# Altium schematic sheet ESP_Xung.SchDoc
size 381 x 241 mm; SheetNumber: 1; SheetTotal: 1
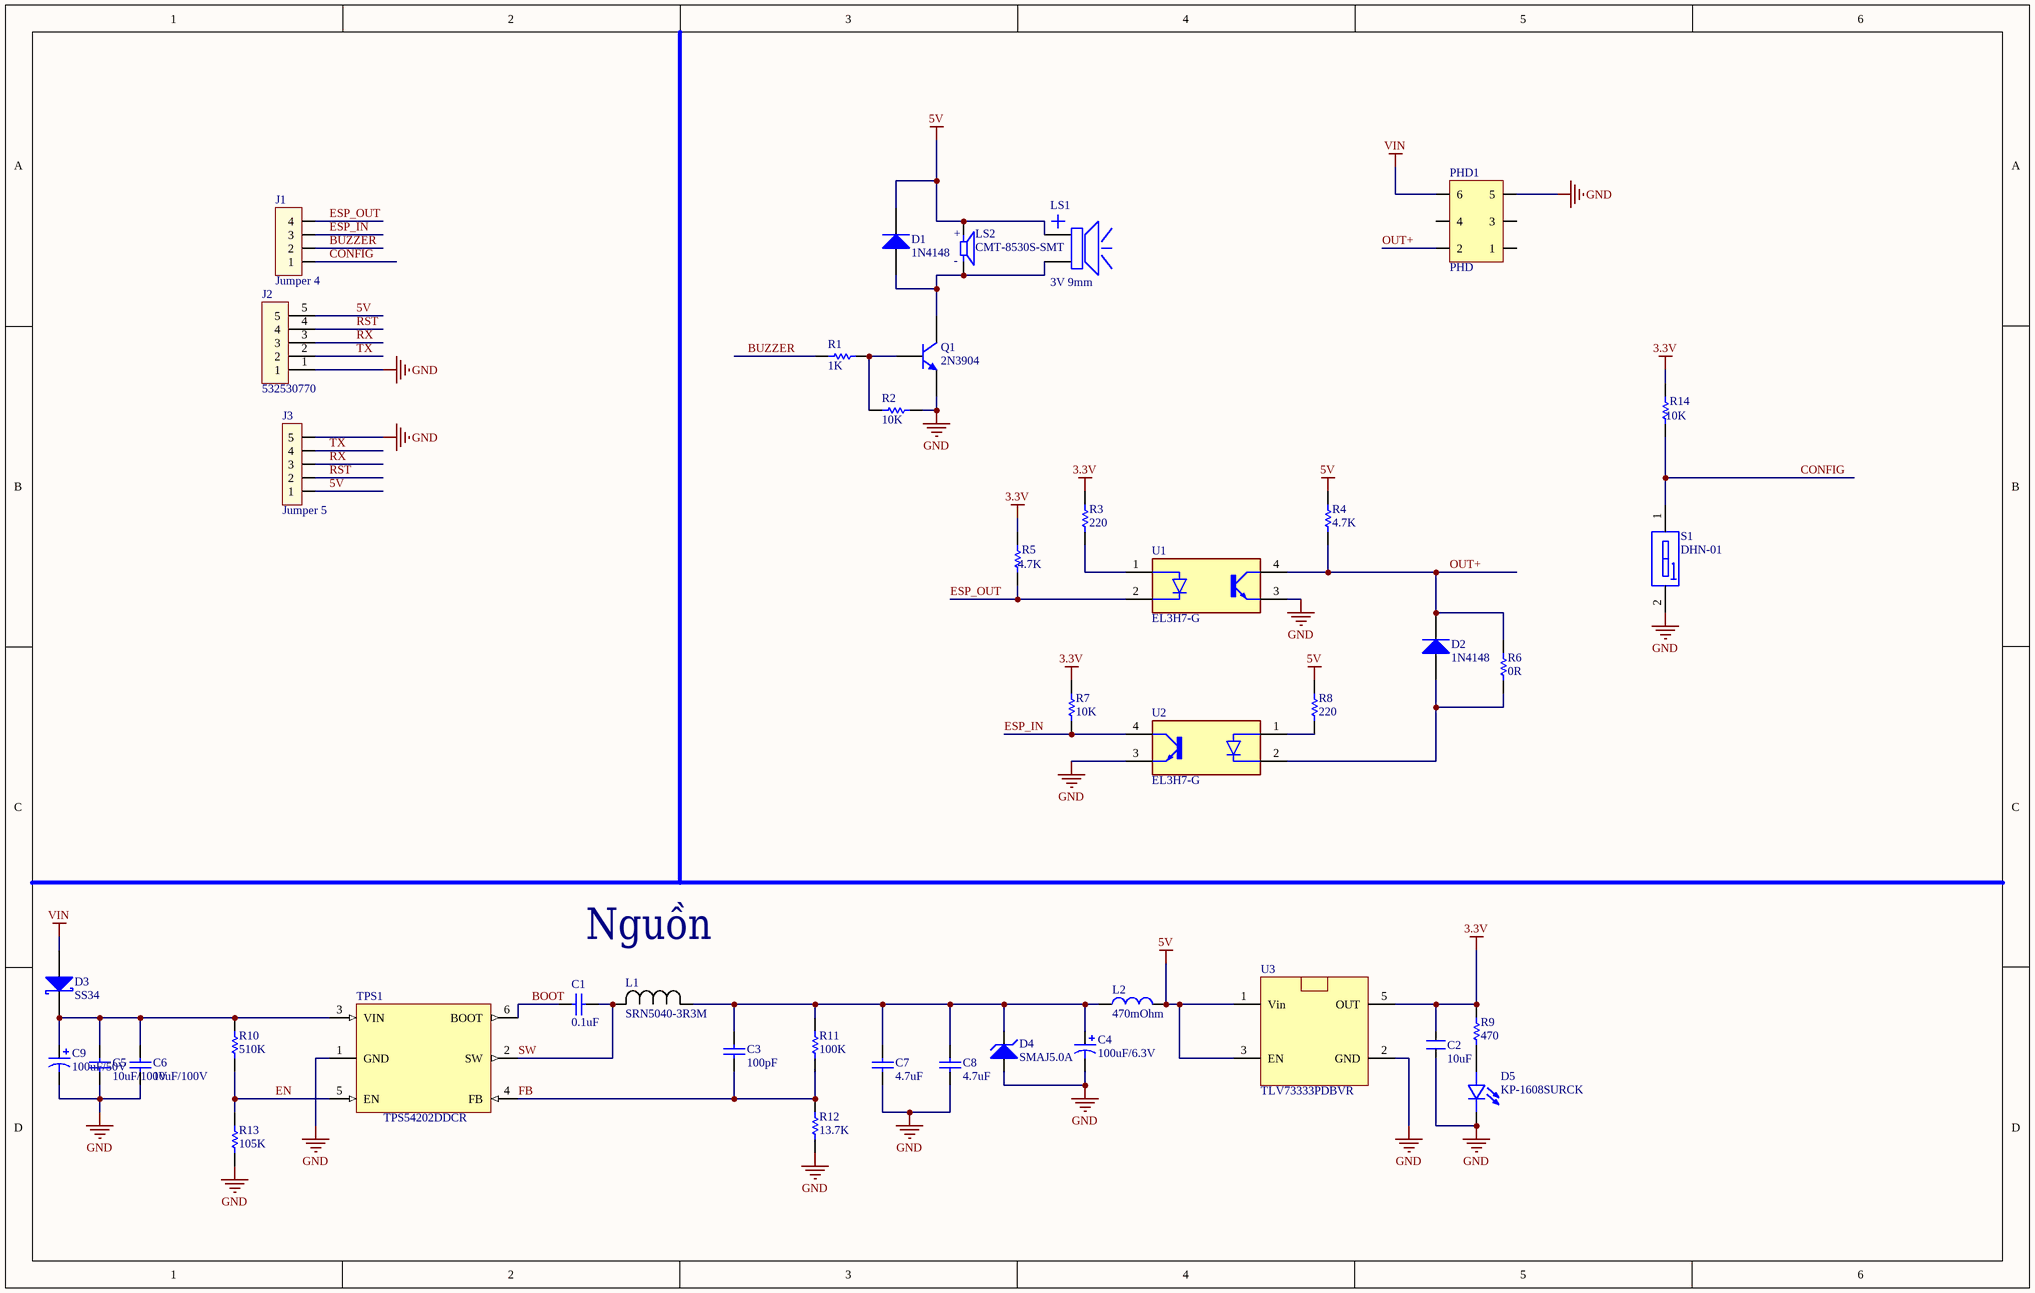
[diagram p0: ESP_Xung.SchDoc]

## Parts
C1  0.1uF  [0603 - C]
C2  10uF  [SM-0805]
C3  100pF  [0603 - C]
C4  value 100uF/6.3V  [3528 - TANTALUM]  (hidden comment: 107B)
C5  10uF/100V  [1210 - C]
C6  10uF/100V  [1210 - C]
C7  Size: 4.7uF  [0603 - C]  (hidden comment: C0603: 4.7uF)
C8  Size: 4.7uF  [0603 - C]  (hidden comment: C0603: 4.7uF)
C9  100uF/50V  [CAP-ALU-SMD 8x11.7x3.1]
D1  1N4148  [SOD-123]
D2  1N4148  [SOD-123]
D3  SS34  [SOD-123]
D4  SMAJ5.0A  [Diode - SMA]
D5  KP-1608SURCK  [LED_KP-1608SURCK]
J1  Jumper 4  [JP4]
J2  532530770  [MOLEX_532530770]
J3  Jumper 5  [JP5 - 1]
L1  SRN5040-3R3M  [IND_SRN5040_BRN]
L2  470mOhm  [0603 - L]
LS1  3V 9mm  [Buzzer]
LS2  CMT-8530S-SMT  [CUI_CMT-8530S-SMT]
PHD1  PHD  [PHD 2.0 2x3]
Q1  2N3904  [SOT23B]
R1  1K  [0603 - R]
R2  10K  [0603 - R]
R3  220  [0603 - R]
R4  4.7K  [0603 - R]
R5  4.7K  [0603 - R]
R6  0R  [0603 - R]
R7  10K  [0603 - R]
R8  220  [0603 - R]
R9  470  [0603 - R]
R10  510K  [0603 - R]
R11  100K  [0603 - R]
R12  13.7K  [0603 - R]
R13  105K  [0603 - R]
R14  10K  [0603 - R]
S1  DHN-01  [DSHP01TSGDER]
TPS1  TPS54202DDCR  [SOT95P280X110-6N]
U1  EL3H7-G  [SOIC127P700X200-4N]
U2  EL3H7-G  [SOIC127P700X200-4N]
U3  TLV73333PDBVR  [SOT23-5]

## Nets
3.3V: C2.2 R3.1 R5.2 R7.1 R9.1 R14.2 U3.5(OUT)
5V: D1.2(K) J2.5 J3.1 L2.2 LS1.1 LS2.P R4.1 R8.1 U3.1(Vin) U3.3(EN)
GND: C2.1 C4.2 C5.1 C6.2 C7.1 C8.1 C9.2 D4.1(A) D5.2(C) J2.1 J3.5 PHD1.4(5) Q1.2(E) R2.2 R12.2 R13.2 S1.2(A2) TPS1.1(GND) U1.3(E) U2.3(E) U3.2(GND)
VIN: D3.1(A) PHD1.5(6)
BOOT: C1.2 TPS1.6(BOOT)
BUZZER: J1.2 R1.1
CONFIG: J1.1 R14.1 S1.1(A1)
EN: R10.2 R13.1 TPS1.5(EN)
ESP_IN: J1.3 R7.2 U2.4(CO)
ESP_OUT: J1.4 R5.1 U1.2(C)
FB: C3.2 R11.2 R12.1 TPS1.4(FB)
OUT+: D2.2(K) PHD1.1 R4.2 R6.1 U1.4(CO)
RST: J2.4 J3.2
RX: J2.3 J3.3
SW: C1.1 L1.2 TPS1.2(SW)
TX: J2.2 J3.4
NetC3_1: C3.1 C4.1 C7.2 C8.2 D4.2(K) L1.1 L2.1 R11.1
NetC5_2: C5.2 C6.1 C9.1 D3.2(K) R10.1 TPS1.3(VIN)
NetD1_1: D1.1(A) LS1.2 LS2.N Q1.3(C)
NetD2_1: D2.1(A) R6.2 U2.2(C)
NetD5_1: D5.1(A) R9.2
NetQ1_1: Q1.1(B) R1.2 R2.1
NetR3_2: R3.2 U1.1(A)
NetR8_2: R8.2 U2.1(A)

Not connected (* = marked no-connect by the designer): PHD1 2(3) 3(4); U3 4(NC)

## Notes on the sheet
- Nguồn
- (in symbol CMT-8530S-SMT) +; -

## Library data of the parts
C1 C3 = Cap 0603 1nF: CAP CER 1000PF 50V C0G/NP0 0603; MPN: CL10C102JB8NNNC; MFR: SAMSUNG; Company ID: VT_TỤ ĐIỆN_C0603 1nF; Size: C0603: 1nF
  C1: Value: 0.1uF
  C3: Value: 100pF
C2 = CM: Cap SMD; Value: 103
C4 = Cap Tan 3528 100uF/6.3V: CAP TANT 100UF 6.3V 10% 1411; MPN: T491B107K006AT; MFR: Kemet; Company ID: VT_CAP TAN 100uF 6.3V
C5 C6 = Cap 1210 10uF: CAP CER 10UF 100V X7S 1210; MFR: Murata Electronics; MPN: GRM32EC72A106KE05L; Company ID: VT_CAP_C1210 10uF 100V; Size: C1210: 10uF/100V; Value: 10uF/100V
C7 C8 = Cap 0603 4.7uF: CAP CER 4.7UF 6.3V X5R 0603; MFR: Taiyo Yuden; MPN: JMK107BJ475KA-T; Company ID: VT_CAP_0603 4.7uF; Value: C0603: 4.7uF
C9 = Cap Alu 100uF/50V: CAP ALUM 100UF 20% 50V SMD; MPN: UWT1H101MNL1GS; MFR: Nichicon; Company ID: VT_CAP ALU 100uF 50V; Value: 100uF/50V
D1 D2 = Diode 1N4148: DIODE GEN PURP 100V 300MA SOD123; MPN: 1N4148W-7-F; MFR: DIODES; Company ID: VT_DIODE_1N4148W-7-F
D3 = Diode SS34: DIODE SCHOTTKY 40V 3A SMA; MPN: NRVBA340T3G; MFR: ON Semiconductor; Company ID: VT_DIODE_ SS34
D4 = Diode SMAJ5.0A: TVS DIODE 5VWM 9.2VC SMA; MFR: Littelfuse Inc.; Company ID: VT_DIODE_ SMAJ5.0A; MPN: SMAJ5.0A
D5 = KP-1608SURCK: LED; SMD; 0603; red; 50-150mcd; 1.6x0.8mm; 120Â°; 20mA;; MF: Kingbright; SnapEDA_Link: https://www.snapeda.com/parts/KP-1608SURCK/Kingbright/view-part/?ref=snap; Package: 0603 Kingbright; Value: *; MP: KP-1608SURCK; Check_prices: https://www.snapeda.com/parts/KP-1608SURCK/Kingbright/view-part/?ref=eda
J1 = JP4: Jumper 4, 2.54mmx4
J2 = 532530770: 2.00mm Pitch, Micro-Latch PCB Header, Single Row, Vertical, Through Hole, Tin (Sn) Plating, 7 Circuits, Tray, 3.50mm PC Tail Length; Package: None; MP: 532530770; Value: *; Price: None; Availability: Unavailable
J3 = JP5: Jumper 5, 2.54mmx5
L1 = SRN5040-3R3M: No Description Available; Mfr_Name: Bourns Electronics; Digi-Key_Part_Number_3: SRN5040-3R3MDKR-ND; Digi-Key_Part_Number_2: SRN5040-3R3MCT-ND; Digi-Key_Part_Number_1: SRN5040-3R3MTR-ND
L2 = Inductor 0603 470mOhm: FERRITE BEAD 470 OHM 0603 1LN; MPN: BLM18PG471SN1D; MFR": Murata; Company ID: VT_IND_0603 470mOhm; Size: L0603: 470mOhm; Value: 470mOhm
LS1 = Speaker: Buzzer 9*6mm (D*h); MFR: China; MPN: TMB09A03; Company ID: VT_Buzzer 3V 9mm
LS2 = CMT-8530S-SMT: Buzzers Transducer, Externally Driven Magnetic 3.6 V 90mA 2.73kHz 87dB @ 3.6V, 10cm Surface Mount Solder Pads; MF: CUI DEVICES; SnapEDA_Link: https://www.snapeda.com/parts/CMT-8530S-SMT/CUI+Devices/view-part/?ref=snap; Value: *; Purchase-URL: https://pricing.snapeda.com/search/part/CMT-8530S-SMT/?ref=eda; Check_prices: https://www.snapeda.com/parts/CMT-8530S-SMT/CUI+Devices/view-part/?ref=eda; Availability: In Stock; Price: None; MP: CMT-8530S-SMT; Package: None
PHD1 = Component_1
Q1 = Transistor 2N3904: TRANS NPN 40V 0.2A SOT-23; MPN: MMBT3904; MFR: Fairchild; Company ID: VT_TRANSISTOR_3904
R1-R14 = Res 0603 1K: RES SMD 1K OHM 1% 1/10W 0603; MFR: Yageo; MPN: RC0603FR-071KL; Company ID: VT_RES_R0603 1K; Size: R0603: 1K
  R1: Value: 1K
  R2 R7 R14: Value: 10K
  R3 R8: Value: 220
  R4 R5: Value: 4.7K
  R6: Value: 0R
  R9: Value: 470
  R10: Value: 510K
  R11: Value: 100K
  R12: Value: 13.7K
  R13: Value: 105K
S1 = SW_DSHP01: Switch 1Bit; MFR: kingtek-switch; MPN: DSHP01TSGER; Company ID: VT_SWITCH_DSHP01; URL: https://item.taobao.com/item.htm?spm=a230r.1.14.36.426a210cpFvAZd&id=577338259474&ns=1&abbucket=1#detail
TPS1 = TPS54202DDCR: 4.5V to 28V Input, 2A Output, EMI Friendly Synchronous Step-Down Converter 6-SOT-23-THIN -40 to 125; MF: Texas Instruments; Price: None; Value: *; Texas_Instruments-Purchase-URL: https://snapeda.com/shop?store=Texas+Instruments&id=565860; Mouser-Purchase-URL: https://snapeda.com/shop?store=Mouser&id=565860; Package: SOT-23-THN-6 Texas Instruments; SnapEDA_Link: https://www.snapeda.com/parts/TPS54202DDCR/Texas%20Instruments/view-part/565860/?ref=snap; Availability: Good; MP: TPS54202DDCR; DigiKey-Purchase-URL: https://snapeda.com/shop?store=DigiKey&id=565860; BuyPart: https://www.snapeda.com/parts/TPS54202DDCR/Texas%20Instruments/view-part/565860/?ref=eda
U1 U2 = EL3H7-G: Optoisolator Transistor Output 3750Vrms 1 Channel 4-SSOP; MF: Everlight Electronics; Check_prices: https://www.snapeda.com/parts/EL3H7-G/Everlight+Electronics+Co+Ltd/view-part/?ref=eda; Value: *; Availability: In Stock; MP: EL3H7-G; Price: None; Package: SSOP-4 Everlight Electronics; SnapEDA_Link: https://www.snapeda.com/parts/EL3H7-G/Everlight+Electronics+Co+Ltd/view-part/?ref=snap
U3 = TLV73333PDBVR: IC REG LINEAR 3.3V 300MA SOT23-5; MFR: TI; Company ID: VT_IC_TLV73333; MPN: TLV73333PDBVR